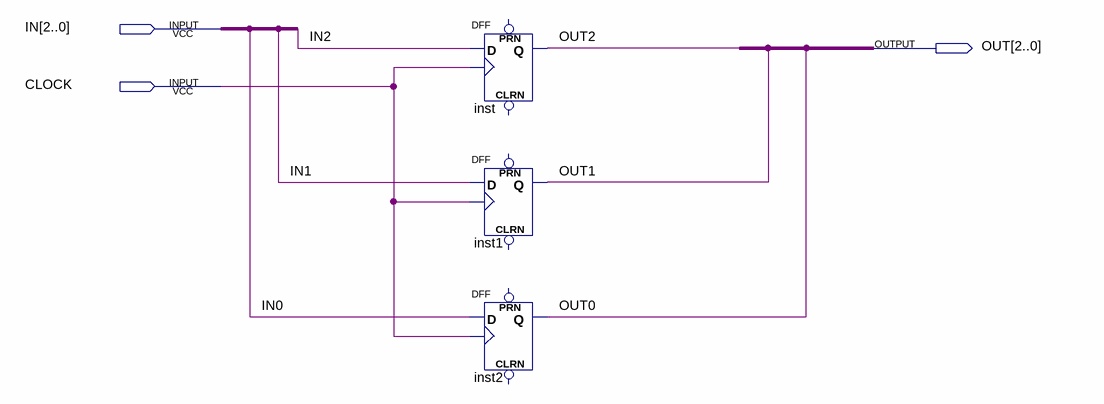
[diagram p0: schematic sheet]
// Quartus schematic RegisterBlock.bdf as structural Verilog: 3 symbols, 3 pins
module RegisterBlock (
  input  [2:0] IN,
  input  CLOCK,
  output [2:0] OUT
);

  DFF inst (.CLK(CLOCK), .D(IN[2]), .Q(OUT[2]));  // open: CLRN, PRN
  DFF inst1 (.CLK(CLOCK), .D(IN[1]), .Q(OUT[1]));  // open: CLRN, PRN
  DFF inst2 (.CLK(CLOCK), .D(IN[0]), .Q(OUT[0]));  // open: CLRN, PRN
endmodule
